# Altium schematic sheet curr_meas_and_mot_conn.SchDoc
size A
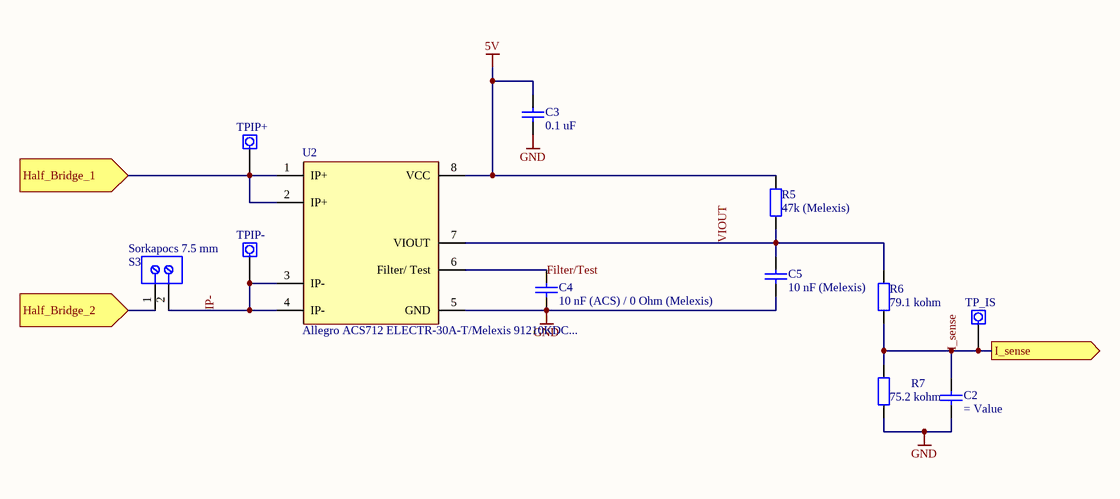
[diagram p0: curr_meas_and_mot_conn.SchDoc]

## Parts
C2  (no value)  [0805_C]
C3  0.1 uF  [0805_C]
C4  10 nF (ACS) / 0 Ohm (Melexis)  [0805_C]
C5  10 nF (Melexis)  [0805_C]
R5  47k (Melexis)  [0805_R]
R6  79.1 kohm  [0805_R]
R7  75.2 kohm  [0805_R]
S3  Sorkapocs 7.5 mm  [Sorkapocs 7.5mm]
TP_IS  Testpoint  [TESTPOINT_1.5]  (value not drawn)  (no BOM)
TPIP+  Testpoint  [TESTPOINT_1.5]  (value not drawn)  (no BOM)
TPIP-  Testpoint  [TESTPOINT_1.5]  (value not drawn)  (no BOM)
U2  Allegro ACS712 ELECTR-30A-T/Melexis 91210KDC...  [SO-8]

## Ports
Half_Bridge_1 (in), Half_Bridge_2 (in), I_sense (out)

## Nets
5V: C3.2 R5.2 U2.8(VCC)
GND: C2.2 C3.1 C4.2 C5.2 R7.1 U2.5(GND)
Filter/Test: C4.1 U2.6(Filter/_Test)
Half_Bridge_1: TPIP+.1 U2.1(IP+) U2.2(IP+) ; port Half_Bridge_1
Half_Bridge_2: S3.1 ; port Half_Bridge_2
I_sense: C2.1 R6.1 R7.2 TP_IS.1 ; port I_sense
IP-: S3.2 TPIP-.1 U2.3(IP-) U2.4(IP-)
VIOUT: C5.1 R5.1 R6.2 U2.7(VIOUT)

## Library data of the parts
C2-C5 = CAP 0805
R5-R7 = RES 0805
TP_IS TPIP+ TPIP- = Testpoint: Part Class: Connector
U2 = Allegro ACS712 ELECTR-30A-T/Melexis 91210KDC...: Áram mérő hall elemes szenzorok, 5V-os tápfeszültséggel; ComponentLink1Description: Farnell.com (ACS712); ComponentLink1URL: https://hu.farnell.com/allegro-microsystems/acs712elctr-30a-t/ic-hall-effect-current-sensor/dp/1651975?st=acs712; ComponentLink2Description: mouser.com (MELEXIS); ComponentLink2URL: https://hu.mouser.com/datasheet/2/734/MLX91210-Datasheet-Melexis-963930.pdf
S3 = Sorkapocs 7.5 mm: ComponentLink1Description: mouser.com; ComponentLink1URL: https://hu.mouser.com/ProductDetail/Phoenix-Contact/1988105?qs=sGAEpiMZZMvZTcaMAxB2ALNEUezFajW2H9fYPecO8pg%3d